# EAGLE schematic lifetile (EAGLE 6.2)
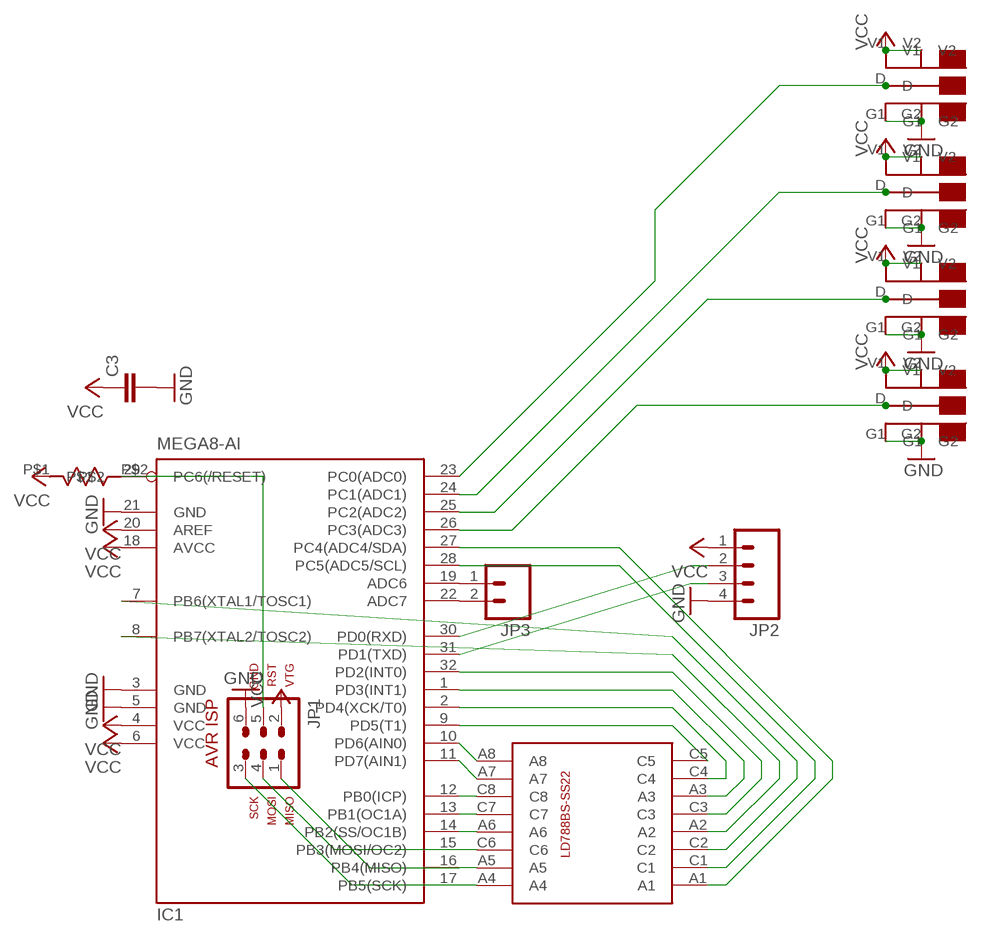
[diagram p0: schematic, sheet 1]

## Parts
C3  CAPKIT  [CAP-PTH-SMALL-KIT]
IC1  MEGA8-AI  [TQFP32-08]
JP1  AVR-ISP-6  [AVR-ISP-6]
JP2  M04LOCK  [1X04_LOCK]
JP3  M02PTH  [1X02]
U$1  LD-1088BS  [LD-1088BS]
U$2  R-7  [R-7]
U$4  EDGE_5_PTH  [EDGE_5_SMT_PTH]
U$5  EDGE_5_PTH  [EDGE_5_SMT_PTH]
U$6  EDGE_5_PTH  [EDGE_5_SMT_PTH]
U$11  EDGE_5_PTH  [EDGE_5_SMT_PTH]

## Nets
GND: C3.2 IC1.3(GND) IC1.5(GND) IC1.21(GND) JP1.6 JP2.4 U$4.G1 U$4.G2 U$5.G1 U$5.G2 U$6.G1 U$6.G2 U$11.G1 U$11.G2
N$1: IC1.17(PB5(SCK)) JP1.3 U$1.A4
N$2: IC1.16(PB4(MISO)) JP1.1 U$1.A5
N$3: IC1.15(PB3(MOSI/OC2)) JP1.4 U$1.C6
N$4: IC1.14(PB2(SS/OC1B)) U$1.A6
N$5: IC1.13(PB1(OC1A)) U$1.C7
N$6: IC1.12(PB0(ICP)) U$1.C8
N$7: IC1.11(PD7(AIN1)) U$1.A7
N$8: IC1.10(PD6(AIN0)) U$1.A8
N$9: IC1.29(PC6(/RESET)) JP1.5 U$2.P$2
N$10: IC1.9(PD5(T1)) U$1.C5
N$11: IC1.2(PD4(XCK/T0)) U$1.C4
N$12: IC1.1(PD3(INT1)) U$1.A3
N$13: IC1.32(PD2(INT0)) U$1.C3
N$14: IC1.8(PB7(XTAL2/TOSC2)) U$1.A2
N$15: IC1.7(PB6(XTAL1/TOSC1)) U$1.C2
N$16: IC1.28(PC5(ADC5/SCL)) U$1.C1
N$17: IC1.27(PC4(ADC4/SDA)) U$1.A1
N$18: IC1.26(PC3(ADC3)) U$4.D
N$19: IC1.30(PD0(RXD)) JP2.2
N$20: IC1.23(PC0(ADC0)) U$11.D
N$21: IC1.31(PD1(TXD)) JP2.3
N$22: IC1.19(ADC6) JP3.1
N$23: IC1.22(ADC7) JP3.2
N$29: IC1.25(PC2(ADC2)) U$5.D
N$30: IC1.24(PC1(ADC1)) U$6.D
VCC: C3.1 IC1.4(VCC) IC1.6(VCC) IC1.18(AVCC) IC1.20(AREF) JP1.2 JP2.1 U$2.P$1 U$4.V1 U$4.V2 U$5.V1 U$5.V2 U$6.V1 U$6.V2 U$11.V1 U$11.V2

## Library data of the parts
C3 = SparkFun-Capacitors:CAP: Capacitor Standard 0603 ceramic capacitor, and 0.1" leaded capacitor.
IC1 = atmel:MEGA8: MICROCONTROLLER 8 Kbytes FLASH, 1 kbytes SRAM, 512 bytes EEPROM, USART, 6-channel 10 bit ADC, 2-channel 8 bit ADC Pin compatible with Atmega48, ATMega88, ATMega168 Source: avr.lbr; MPN: ATMEGA8-16AU; OC_FARNELL: 9171371; OC_NEWARK: 73M8863
JP1 = avr-5-4.16:AVR-ISP-6: AVR ISP-6 Serial Programming Header
JP2 = SparkFun-Connectors:M04: Header 4 Standard 4-pin 0.1" header. Use with straight break away headers (SKU : PRT-00116), right angle break away headers (PRT-00553), swiss pins (PRT-00743), machine pins (PRT-00117), and female headers (PRT-00115). Molex polarized connector foot print use with SKU : PRT-08231 with associated crimp pins and housings. 1MM SMD Version SKU: PRT-10208
JP3 = SparkFun-Connectors:M02: Header 2 Standard 2-pin 0.1" header. Use with straight break away headers (SKU : PRT-00116), right angle break away headers (PRT-00553), swiss pins (PRT-00743), machine pins (PRT-00117), and female headers (PRT-00115). Molex polarized connector foot print use with SKU : PRT-08233 with associated crimp pins and housings.
U$1 = Mrule:LD-1088BS
U$2 = Mrule:R-7
U$4-U$6 U$11 = Mrule:EDGE_5_PTH